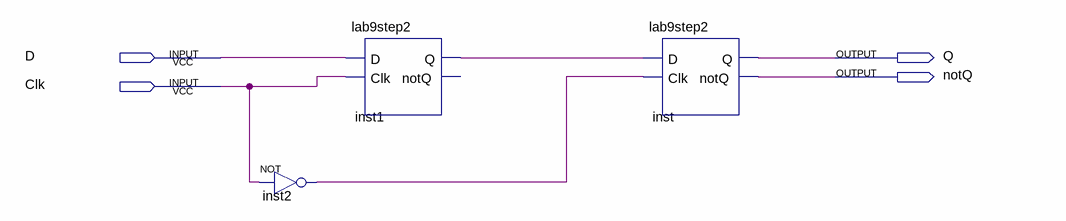
[diagram p0: schematic sheet]
// Quartus schematic lab9step3a.bdf as structural Verilog: 3 symbols, 4 pins
module lab9step3a (
  input  D,
  input  Clk,
  output Q,
  output notQ
);

  wire inst1_q, inst2_out;

  not inst2 (inst2_out, Clk);
  lab9step2 inst1 (.D(D), .Clk(Clk), .Q(inst1_q));  // open: notQ
  lab9step2 inst (.D(inst1_q), .Clk(inst2_out), .Q(Q), .notQ(notQ));
endmodule
